# EAGLE design detector de IMPACTO (EAGLE 6.5.0)
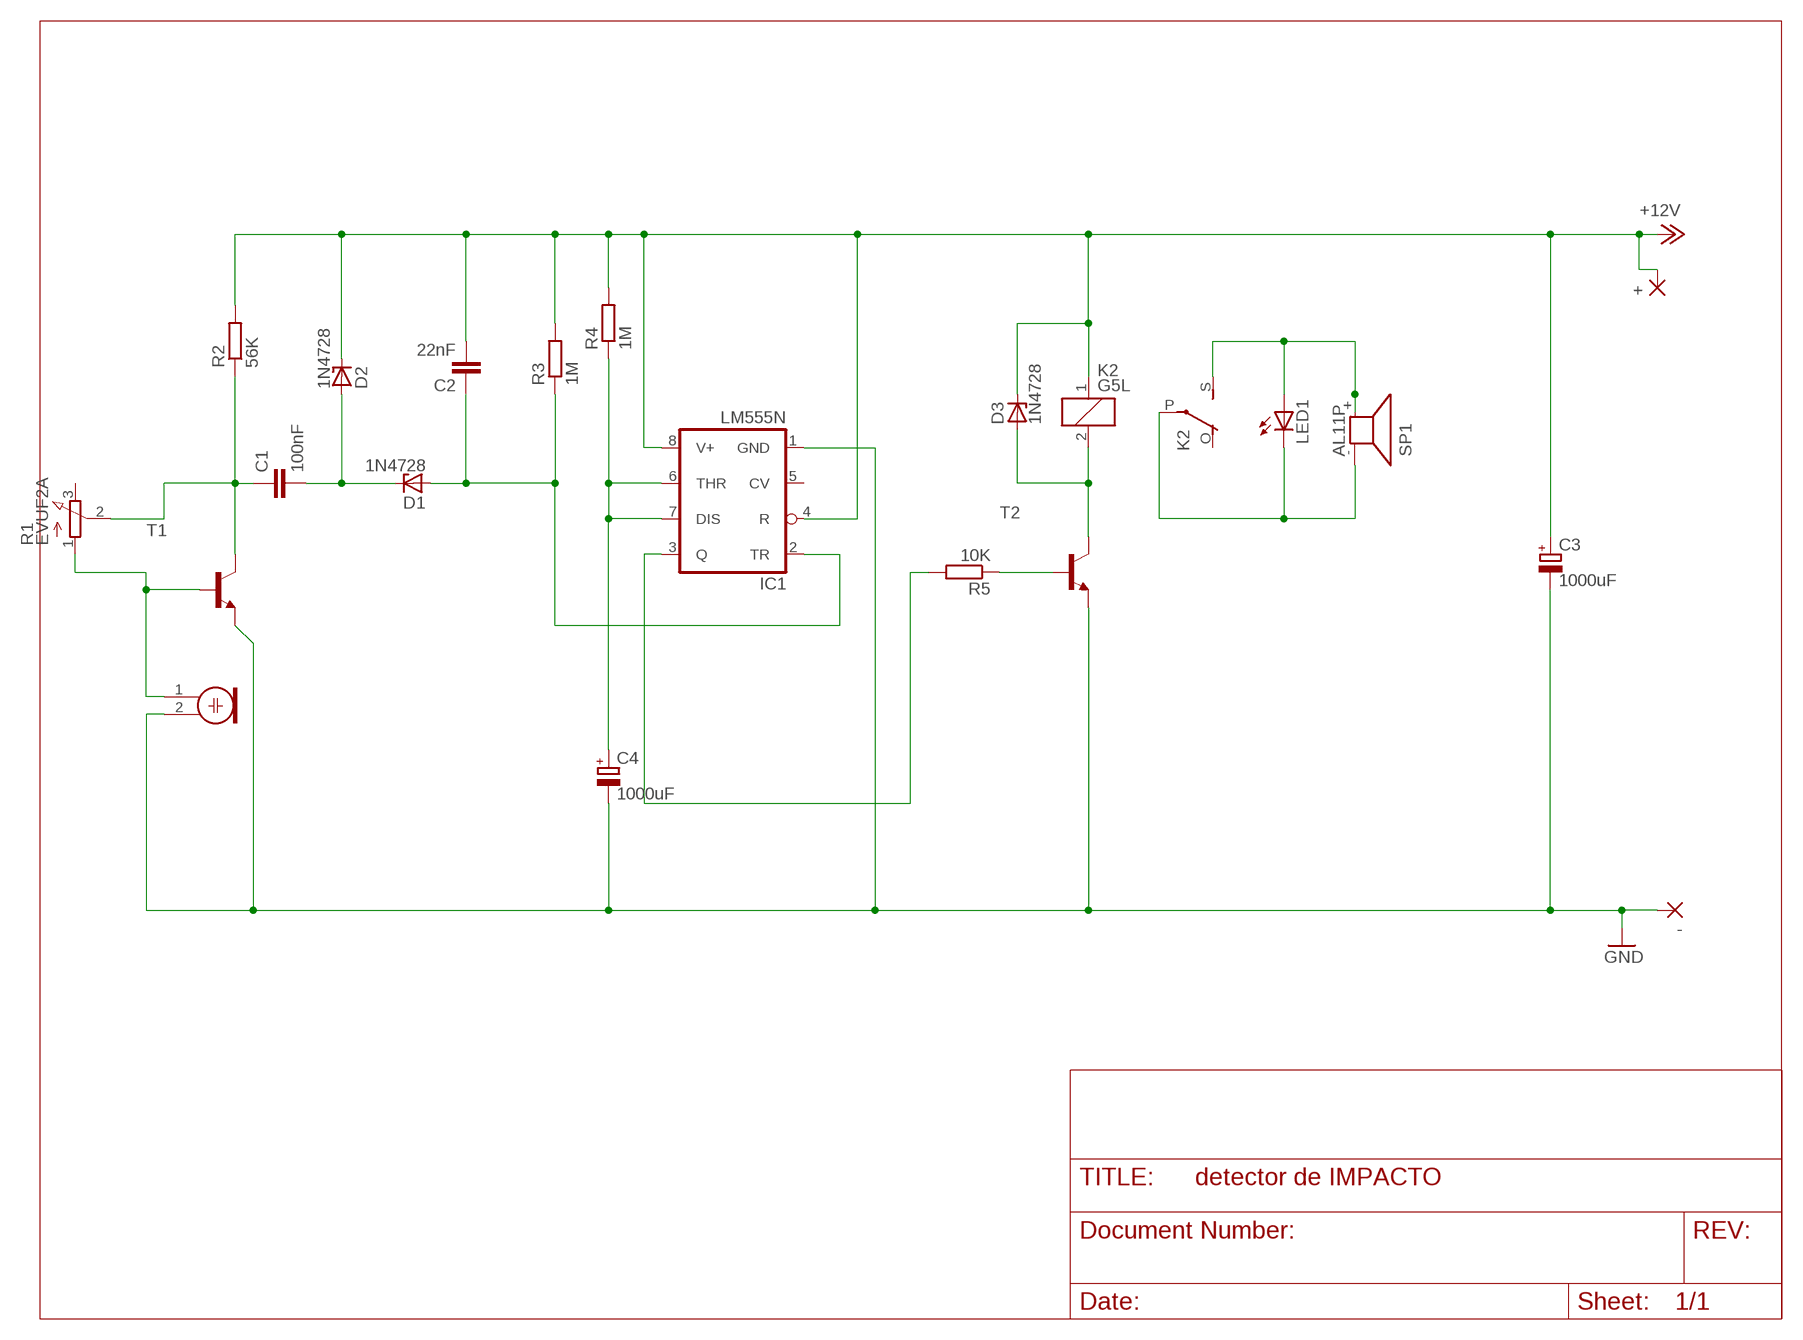
[diagram p0: schematic, sheet 1]

## Parts
+  1,6/0,8  [1,6/0,8]
-  1,6/0,8  [1,6/0,8]
C1  100nF  C-EU025-024X044  [C025-024X044]
C2  22nF  C-EU025-024X044  [C025-024X044]
C3  1000uF  CPOL-EUE5-8.5  [E5-8,5]
C4  1000uF  CPOL-EUE5-8.5  [E5-8,5]
D1  1N4728  [DO41Z10]
D2  1N4728  [DO41Z10]
D3  1N4728  [DO41Z10]
IC1  LM555N  [DIL08]
K2  G5L  [G5LE]
LED1  LED3MM  [LED3MM]
M1  ELECTRET_MICROPHON-WM-64PC/64PK  [WM-64PC/64PK]
R1  EVUF2A  [EVUF]
R2  56K  R-EU_0207/10  [0207/10]
R3  1M  R-EU_0207/10  [0207/10]
R4  1M  R-EU_0207/10  [0207/10]
R5  10K  R-EU_0207/10  [0207/10]
SP1  AL11P  [AL11P]
T1  BC548-NPN-TO92-CBE  [TO92-CBE]
T2  BC548-NPN-TO92-CBE  [TO92-CBE]

## Nets
+12V: +.1(P) C2.2 C3.+ D2.C D3.C IC1.4(R) IC1.8(V+) K2.1 R2.2 R3.2 R4.2
GND: -.1(P) C3.- C4.- IC1.1(GND) M1.2 T1.E T2.E
N$1: C1.1 R1.2(S) R2.1 T1.C
N$2: M1.1 R1.1(A) T1.B
N$3: C1.2 D1.C D2.A
N$4: C2.1 D1.A IC1.2(TR) R3.1
N$6: IC1.3(Q) R5.2
N$7: K2.S(2:S) LED1.A SP1.+
N$8: C4.+ IC1.6(THR) IC1.7(DIS) R4.1
N$9: R5.1 T2.B
N$10: D3.A K2.2 T2.C
N$12: K2.P(2:P) LED1.K(C) SP1.-
Unconnected: IC1.5(CV) K2.O(2:O) R1.3(E)

## Library data of the parts
+ - = wirepad:1,6/0,8: THROUGH-HOLE PAD
C1 C2 = resistor:C-EU: CAPACITOR, European symbol
C3 C4 = rcl:CPOL-EU: POLARIZED CAPACITOR, European symbol
D1-D3 = diode:1N4728: Z DIODE 3.3 V, 1W, 5 percent
IC1 = linear:*555: TIMER
K2 = relay:G5L: RELAY 1 x switch, 10 A/120 V AC, 8 A/30 V ADC, Omron; OC_FARNELL: unknown; OC_NEWARK: unknown
LED1 = led:LED: LED OSRAM: - CHIPLED LG R971, LG N971, LY N971, LG Q971, LY Q971, LO R971, LY R971 LH N974, LH R974 LS Q976, LO Q976, LY Q976 LO Q996 - Hyper CHIPLED LW Q18S LB Q993, LB Q99A, LB R99A - SideLED LS A670, LO A670, LY A670, LG A670, LP A670 LB A673, LV A673, LT A673, LW A673 LH A674 LY A675 LS A676, LA A676, LO A676, LY A676, LW A676 LS A679, LY A679, LG A679 - Hyper Micro SIDELED® LS Y876, LA Y876, LO Y876, LY Y876 LT Y87S - SmartLED LW L88C, LW L88S LB L89C, LB L89S, LG L890 LS L89K, LO L89K, LY L89K LS L896, LA L896, LO L896, LY L896 - TOPLED LS T670, LO T670, LY T670, LG T670, LP T670 LSG T670, LSP T670, LSY T670, LOP T670, LYG T670 LG T671, LOG T671, LSG T671 LB T673, LV T673, LT T673, LW T673 LH T674 LS T676, LA T676, LO T676, LY T676, LB T676, LH T676, LSB T676, LW T676 LB T67C, LV T67C, LT T67C, LS T67K, LO T67K, LY T67K, LW E67C LS E67B, LA E67B, LO E67B, LY E67B, LB E67C, LV E67C, LT E67C LW T67C LS T679, LY T679, LG T679 LS T770, LO T770, LY T770, LG T770, LP T770 LB T773, LV T773, LT T773, LW T773 LH T774 LS E675, LA E675, LY E675, LS T675 LS T776, LA T776, LO T776, LY T776, LB T776 LHGB T686 LT T68C, LB T68C - Hyper Mini TOPLED® LB M676 - Mini TOPLED Santana® LG M470 LS M47K, LO M47K, LY M47K Source: http://www.osram.convergy.de LUXEON: - LUMILED® LXK2-PW12-R00, LXK2-PW12-S00, LXK2-PW14-U00, LXK2-PW14-V00 LXK2-PM12-R00, LXK2-PM12-S00, LXK2-PM14-U00 LXK2-PE12-Q00, LXK2-PE12-R00, LXK2-PE12-S00, LXK2-PE14-T00, LXK2-PE14-U00 LXK2-PB12-K00, LXK2-PB12-L00, LXK2-PB12-M00, LXK2-PB14-N00, LXK2-PB14-P00, LXK2-PB14-Q00 LXK2-PR12-L00, LXK2-PR12-M00, LXK2-PR14-Q00, LXK2-PR14-R00 LXK2-PD12-Q00, LXK2-PD12-R00, LXK2-PD12-S00 LXK2-PH12-R00, LXK2-PH12-S00 LXK2-PL12-P00, LXK2-PL12-Q00, LXK2-PL12-R00 Source: www.luxeon.com KINGBRIGHT: KA-3528ASYC Source: www.kingbright.com
M1 = microphon:ELECTRET_MICROPHON-: Electret Condenser Microphone
R1 = pot:EVU: 9 mm Square Rotary Potentiometers Source: Panasonic
R2-R5 = rcl:R-EU_: RESISTOR, European symbol
SP1 = buzzer:AL11P: SPEAKER Source: Buerklin; OC_FARNELL: unknown; OC_NEWARK: unknown
T1 T2 = transistor:*-NPN-: NPN Transistror BF959 corrected 2008.03.06

## Board
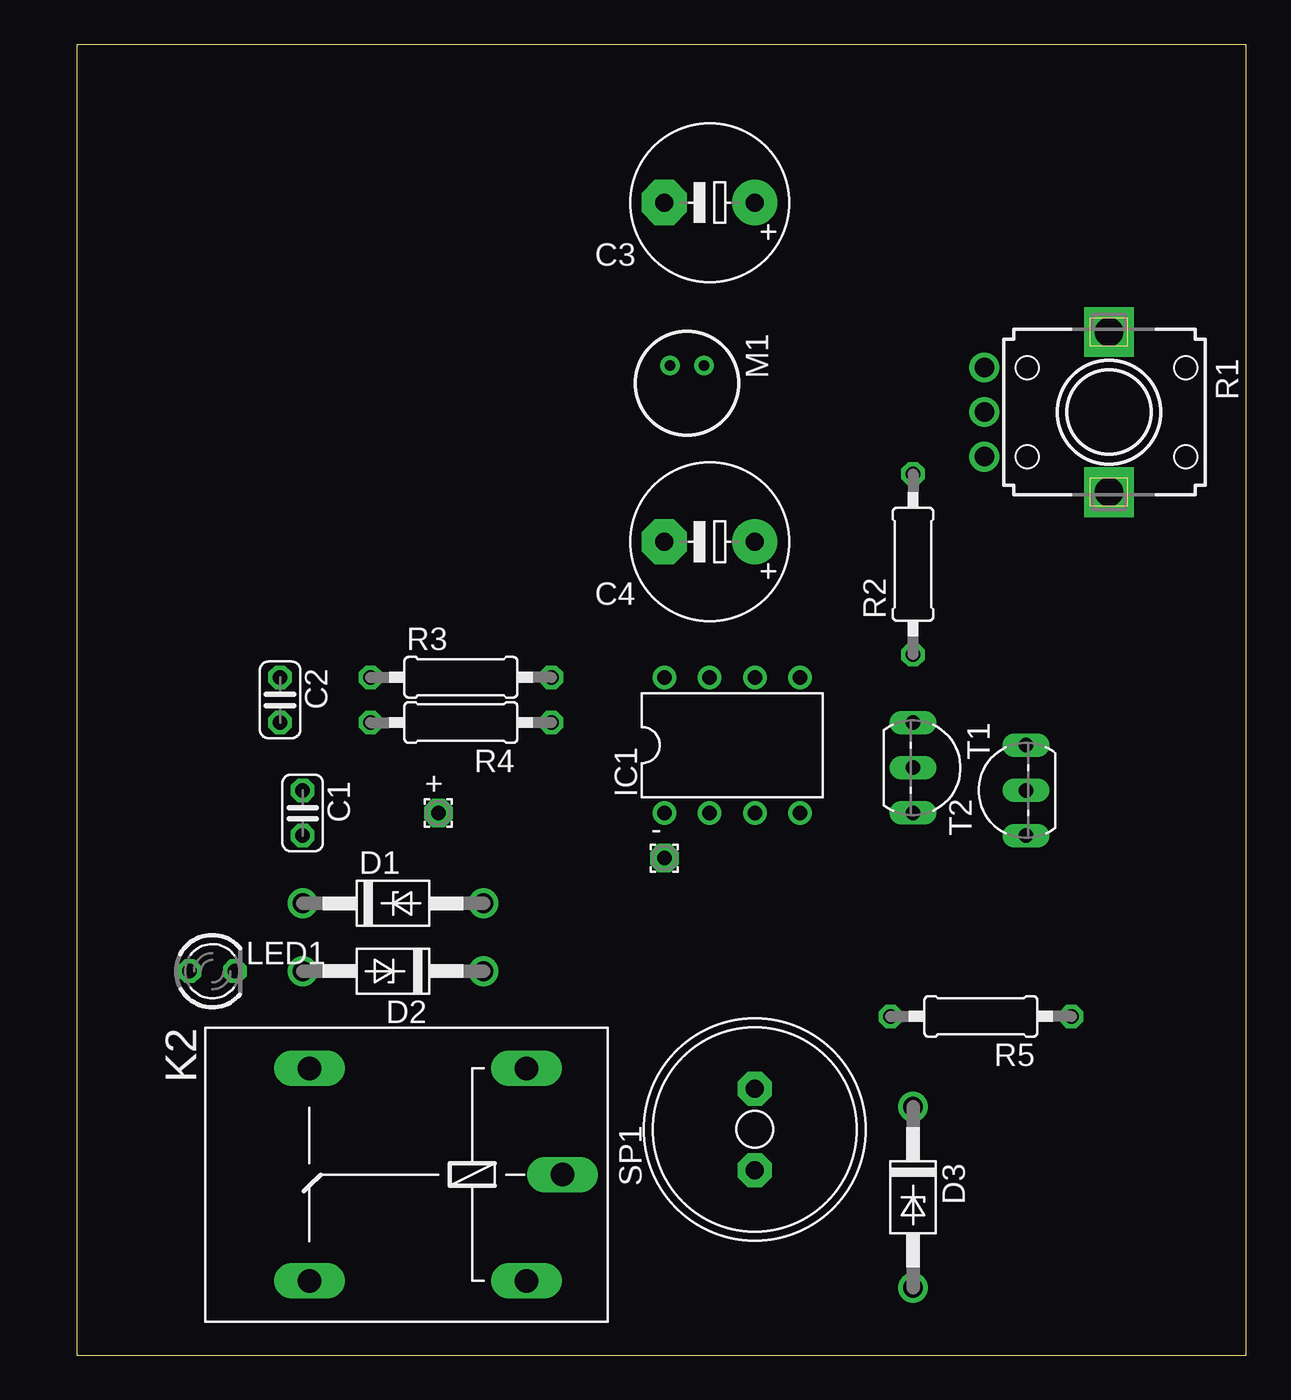
[diagram p1: board, top side]
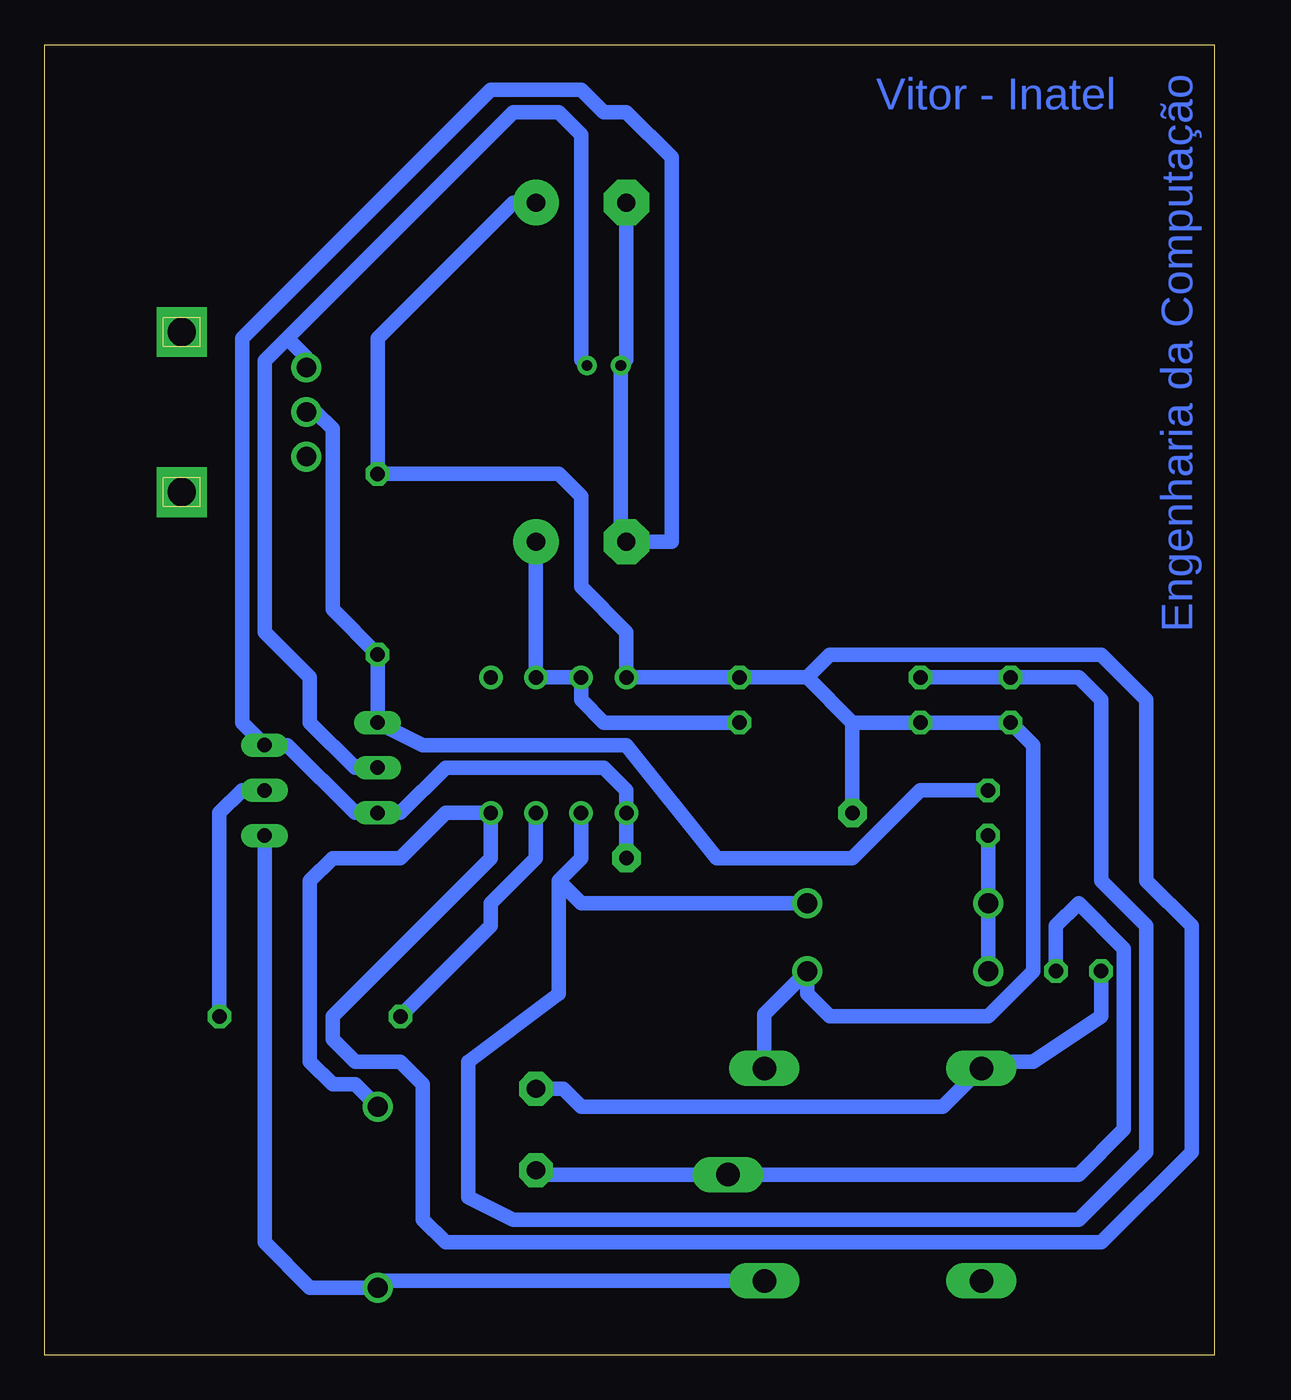
[diagram p2: board, bottom side, seen from below]

Size 65.71 x 73.65 mm. Coordinates in mm from the lower left corner, seen from the top.
Outline: 0,0 65.71,0 65.71,73.65 0,73.65 0,0
Copper layers (1*16): Top 0.035mm / dielectric 1.5mm / Bottom 0.035mm
Design rules "default": minimum track width 10mil, minimum drill 24mil, track to track 8mil, track to pad 8mil, pad to pad 8mil, via to via 8mil, smd to smd 8mil, copper to edge 40mil, drill to drill 8mil, minimum pad ring 10mil, minimum via ring 8mil, stop-mask expansion 4mil, vias tented up to drill 0mil, thermal gap 10mil

### Footprints (pad centres in the part's own frame; a part is rotated, then mirrored left to right if it is on the bottom)
1,6/0,8 = drill 0.813 pad 1.6 octagon: 1 0,0
C025-024X044 = drill 0.813 octagon: 1 -1.27,0; 2 1.27,0
E5-8,5 = drill 1.016 pad 2.54: + -2.54,0 | drill 1.016 pad 2.54 octagon: - 2.54,0
DO41Z10 = drill 1.118: A 5.08,0; C -5.08,0
DIL08 = drill 0.813 pad 1.27: 1 -3.81,-3.81; 2 -1.27,-3.81; 3 1.27,-3.81; 4 3.81,-3.81; 5 3.81,3.81; 6 1.27,3.81; 7 -1.27,3.81; 8 -3.81,3.81
G5LE = drill 1.321 long: 1 -7.493,-5.969; 2 -7.493,5.969; O 4.699,5.969; P -9.525,0; S 4.699,-5.969
LED3MM = drill 0.813 octagon: A -1.27,0; K 1.27,0
WM-64PC/64PK = drill 0.6 pad 1: 1 -1,0.95; 2 -1,-0.95
EVUF = drill 1.1 pad 1.676: 1 -2.5,-7; 2 0,-7; 3 2.5,-7 | drill 1.6 pad 2.8 square: M1 4.5,0; M2 -4.5,0
0207/10 = drill 0.813 octagon: 1 -5.08,0; 2 5.08,0
AL11P = drill 1.016 pad 1.905 octagon: + 2.286,0; - -2.286,0
TO92-CBE = drill 0.813 long: B 0,0; C -2.54,0; E 2.54,0

### Placement (x,y rotation side)
+  20.32,30.48 0 top
-  33.02,27.94 0 top
C1  12.7,30.48 270 top
C2  11.43,36.83 270 top
C3  35.56,64.77 180 top
C4  35.56,45.72 180 top
D1  17.78,25.4 0 top
D2  17.78,21.59 180 top
D3  46.99,8.89 270 top
IC1  36.83,34.29 0 top
K2  17.78,10.16 180 top
LED1  7.62,21.59 0 top
M1  34.29,54.61 270 top
R1  58,53 270 top
R2  46.99,44.45 90 top
R3  21.59,38.1 0 top
R4  21.59,35.56 180 top
R5  50.8,19.05 180 top
SP1  38.1,12.7 90 top
T1  46.99,33.02 270 top
T2  53.34,31.75 90 top

### Tracks (layer width: path | path; a pad name or v marks a point on that pad's centre or on a via)
+12V
  Bottom 0.813: K2.1 25.27,19.18 D2.C 22.86,20.32 21.59,19.05 12.7,19.05 10.16,21.59 10.16,34.29 C2.2 R4.2 20.32,35.56 | 20.32,35.56 22.86,38.1 | 22.86,38.1 R3.2 IC1.8 33.02,40.64 35.56,43.18 35.56,48.26 36.83,49.53 R2.2 46.99,57.15 39.37,64.77 C3.+ | D3.C 48.26,15.24 49.53,15.24 50.8,16.51 50.8,26.67 49.53,27.94 45.72,27.94 43.18,30.48 IC1.4 40.64,27.94 49.53,19.05 49.53,17.78 48.26,16.51 45.72,16.51 44.45,15.24 44.45,7.62 43.18,6.35 6.35,6.35 1.27,11.43 1.27,24.13 3.81,26.67 3.81,36.83 6.35,39.37 21.59,39.37 22.86,38.1 | +.1 20.32,35.56
GND
  Bottom 0.813: C3.- 33.02,55.93 M1.2 33.34,46.04 C4.- 30.48,45.72 30.48,67.31 33.02,69.85 34.29,69.85 35.56,71.12 40.64,71.12 54.61,57.15 54.61,35.56 T2.E 52.07,34.29 48.26,30.48 T1.E 45.72,30.48 43.18,33.02 34.29,33.02 33.02,31.75 IC1.1 -.1
N$1
  Bottom 0.813: C1.1 16.51,31.75 20.32,27.94 27.94,27.94 33.02,34.29 44.45,34.29 T1.C R2.1 49.53,41.91 49.53,52.07 50.46,53 R1.2
N$2
  Bottom 0.813: 52.07,57.15 53.34,55.88 53.34,40.64 50.8,38.1 50.8,35.56 48.26,33.02 T1.B | 52.07,57.15 39.37,69.85 36.83,69.85 35.56,68.58 35.56,55.93 M1.1 | R1.1 51,56.08 52.07,57.15
N$3
  Bottom 0.813: D2.A D1.C C1.2
N$4
  Bottom 0.813: C2.1 R3.1 7.62,38.1 6.35,36.83 6.35,26.67 3.81,24.13 3.81,11.43 7.62,7.62 39.37,7.62 41.91,8.89 41.91,16.51 36.83,20.32 36.83,26.67 | 36.83,26.67 35.56,27.94 IC1.2 | D1.A 35.56,25.4 36.83,26.67
N$6
  Bottom 0.813: IC1.3 38.1,27.94 40.64,25.4 40.64,24.13 R5.2
N$7
  Bottom 0.813: LED1.A 6.35,19.05 10.16,16.51 12.7,16.51 K2.S 15.24,13.97 35.56,13.97 36.58,14.99 SP1.+
N$8
  Bottom 0.813: C4.+ IC1.6 IC1.7 35.56,36.83 34.29,35.56 R4.1
N$9
  Bottom 0.813: T2.B 54.61,31.75 55.88,30.48 R5.1
N$10
  Bottom 0.813: K2.2 46.61,4.19 D3.A 50.8,3.81 53.34,6.35 T2.C
N$12
  Bottom 0.813: SP1.- 37.85,10.16 K2.P 7.62,10.16 5.08,12.7 5.08,22.86 7.62,25.4 8.89,24.13 LED1.K

### Text on the board
Bottom: Engenharia da Computação | Vitor - Inatel